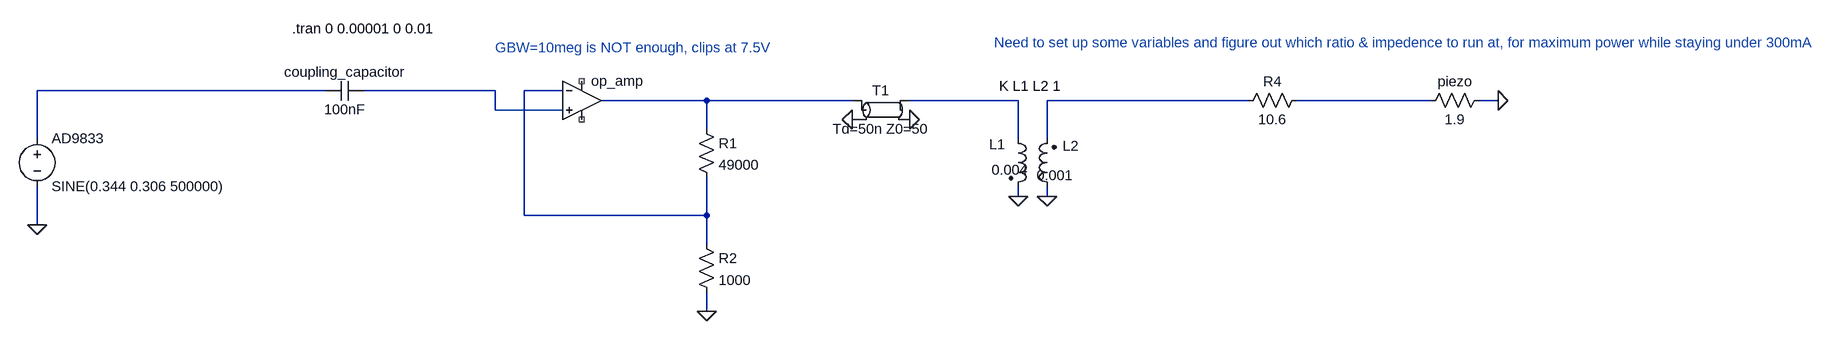
[diagram p0: schematic driver-circuit-2.asc]
driver-circuit-2.asc, the LTspice schematic file:
Version 4
SHEET 1 3916 1140
WIRE 800 192 176 192
WIRE 1088 192 864 192
WIRE 1200 192 1136 192
WIRE 1440 208 1264 208
WIRE 1984 208 1440 208
WIRE 2576 208 2080 208
WIRE 2960 208 2624 208
WIRE 3264 208 3040 208
WIRE 3376 208 3344 208
WIRE 1088 224 1088 192
WIRE 1200 224 1088 224
WIRE 1440 256 1440 208
WIRE 176 272 176 192
WIRE 2576 272 2576 208
WIRE 2624 272 2624 208
WIRE 2576 368 2576 352
WIRE 2624 368 2624 352
WIRE 1136 400 1136 192
WIRE 1440 400 1440 336
WIRE 1440 400 1136 400
WIRE 176 416 176 352
WIRE 1440 448 1440 400
WIRE 1440 560 1440 528
FLAG 176 416 0
FLAG 1440 560 0
FLAG 2624 368 0
FLAG 2576 368 0
FLAG 1984 240 0
FLAG 2080 240 0
FLAG 3376 208 0
SYMBOL voltage 176 256 R0
SYMATTR InstName AD9833
SYMATTR Value SINE(0.344 0.306 500000)
SYMBOL Cap 864 176 R90
WINDOW 0 0 32 VBottom 2
WINDOW 3 32 32 VTop 2
SYMATTR InstName coupling_capacitor
SYMATTR Value 100nF
SYMBOL OpAmps/UniversalOpAmp 1232 208 R0
SYMATTR InstName op_amp
SYMATTR Value2 Avol=1Meg GBW=100Meg Vos=0
SYMBOL Res 1424 240 R0
SYMATTR InstName R1
SYMATTR Value 49000
SYMBOL Res 1424 432 R0
SYMATTR InstName R2
SYMATTR Value 1000
SYMBOL ind2 2560 256 R0
WINDOW 0 -32 26 Left 2
WINDOW 3 -28 68 Left 2
SYMATTR InstName L1
SYMATTR Value 0.004
SYMBOL ind2 2640 368 R180
WINDOW 0 -37 84 Left 2
WINDOW 3 -28 35 Left 2
SYMATTR InstName L2
SYMATTR Value 0.001
SYMBOL Res 3360 192 R90
WINDOW 0 0 56 VBottom 2
WINDOW 3 32 56 VTop 2
SYMATTR InstName piezo
SYMATTR Value 1.9
SYMBOL tline 2032 224 R0
SYMATTR InstName T1
SYMBOL Res 3056 192 R90
WINDOW 0 0 56 VBottom 2
WINDOW 3 32 56 VTop 2
SYMATTR InstName R4
SYMATTR Value 10.6
TEXT 744 88 Left 2 !.tran 0 0.00001 0 0.01
TEXT 2544 184 Left 2 !K L1 L2 1
TEXT 1088 120 Left 2 ;GBW=10meg is NOT enough, clips at 7.5V
TEXT 2536 112 Left 2 ;Need to set up some variables and figure out which ratio & impedence to run at, for maximum power while staying under 300mA

The netlist it stands for:
* driver-circuit-2.asc
V§AD9833 N001 0 SINE(0.344 0.306 500000)
coupling_capacitor N002 N001 100nF
Xop_amp N002 N003 NC_01 NC_02 N004 level1 Avol=1Meg GBW=100Meg Vos=0 En=0 Enk=0 In=0 Ink=0 Rin=500Meg  ; pins In+ In- V+ V- OUT
R1 N004 N003 49000
R2 N003 0 1000
L1 N005 0 0.004
L2 0 N006 0.001
R§piezo 0 N007 1.9
T1 N004 0 N005 0 Td=50n Z0=50
R4 N007 N006 10.6
.tran 0 0.00001 0 0.01
K L1 L2 1
* GBW=10meg is NOT enough, clips at 7.5V
* Need to set up some variables and figure out which ratio & impedence to run at, for maximum power while staying under 300mA
.lib UniversalOpAmp1.lib
.backanno
.end